# EAGLE schematic StandUp (EAGLE 7.6.0)
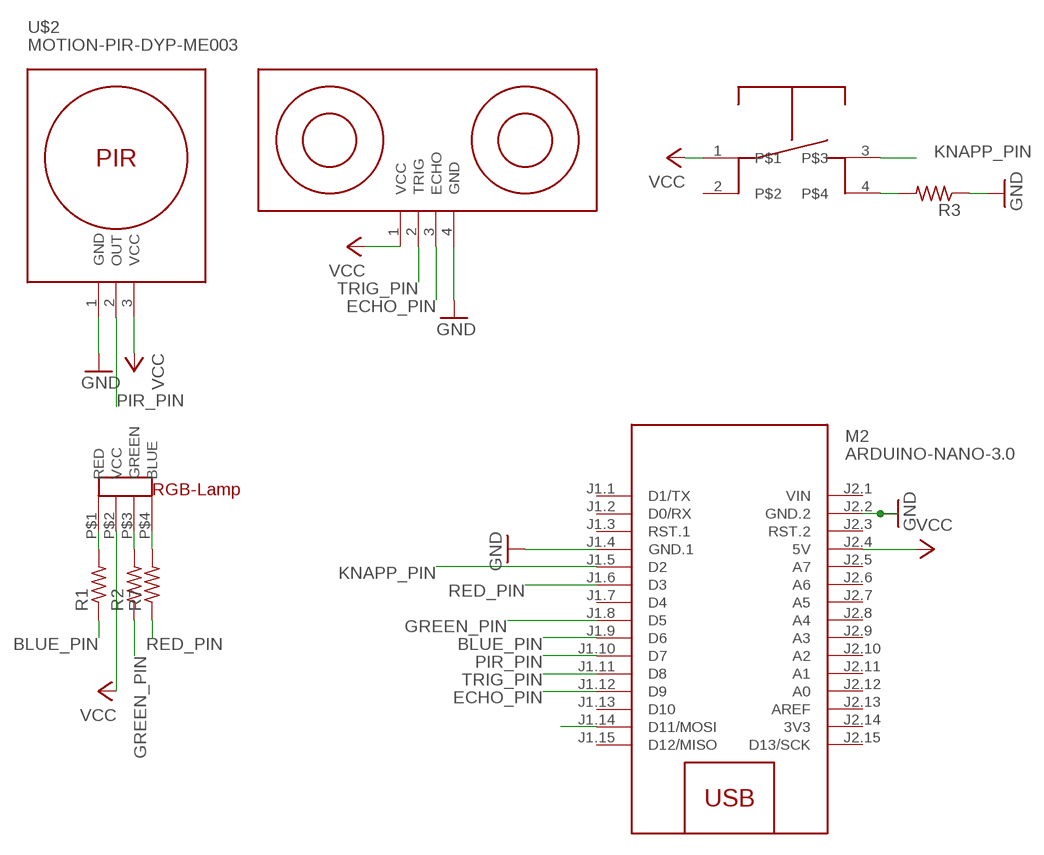
[diagram p0: schematic, sheet 1]

## Parts
M2  ARDUINO-NANO-3.0  [ARDUINO-NANO-3.0]
R1  R-US_0204/7  [0204/7]
R2  R-US_0204/7  [0204/7]
R3  R-US_0204/7  [0204/7]
R7  R-US_0204/7  [0204/7]
U$2  MOTION-PIR-DYP-ME003  [MOTION-PIR-DYP-ME003]
U$3  ULTRASONIC-HC-SR04#V  [ULTRASONIC-HC-SR04#V]
U$4  KNAPP-TSA  [KNAPP-TSA]
U$5  RGBLAMP  [RGBLAMP]

## Nets
BLUE_PIN: M2.J1.9(D6) R1.1
ECHO_PIN: M2.J1.12(D9) U$3.3(ECHO)
GND: M2.J1.4(GND.1) M2.J2.2(GND.2) R3.1 U$2.1(GND) U$3.4(GND)
GREEN_PIN: M2.J1.8(D5) R2.1
KNAPP_PIN: M2.J1.5(D2) U$4.3
MOSI_SPI: M2.J1.14(D11/MOSI)
N$1: R2.2 U$5.P$3(GREEN)
N$2: R7.2 U$5.P$4(BLUE)
N$3: R1.2 U$5.P$1(RED)
N$4: R3.2 U$4.4
PIR_PIN: M2.J1.10(D7) U$2.2(OUT)
RED_PIN: M2.J1.6(D3) R7.1
TRIG_PIN: M2.J1.11(D8) U$3.2(TRIG)
VCC: M2.J2.4(5V) U$2.3(VCC) U$3.1(VCC) U$4.1 U$5.P$2(VCC)
Unconnected: M2.J1.1(D1/TX) M2.J1.2(D0/RX) M2.J1.3(RST.1) M2.J1.7(D4) M2.J1.13(D10) M2.J1.15(D12/MISO) M2.J2.3(RST.2) M2.J2.5(A7) M2.J2.6(A6) M2.J2.7(A5) M2.J2.8(A4) M2.J2.9(A3) M2.J2.10(A2) M2.J2.11(A1) M2.J2.12(A0) M2.J2.13(AREF) M2.J2.15(D13/SCK) U$4.2

## Power pins joined to a net without a drawn wire
3V3: M2.J2.14(3V3)
VIN: M2.J2.1(VIN)

## Library data of the parts
M2 = diy-modules:ARDUINO-NANO-3.0: Arduino Nano 3.0
R1-R3 R7 = rcl:R-US_: RESISTOR, American symbol
U$2 = diy-modules:MOTION-PIR-DYP-ME003: PIR Motion Sensor Module DYP-ME003 based on BISS0001 pyroelectic detector
U$3 = diy-modules:ULTRASONIC-HC-SR04: Ultrasonic Ranging Module HC-SR04
U$4 = Wassberg:KNAPP-TSA
U$5 = sebastian:RGBLAMP

## Net classes
0 default: width 0.508 mm, drill 0.508 mm, clearance 0.508 mm